# EAGLE design 3x3_Matrix (EAGLE 5.11)
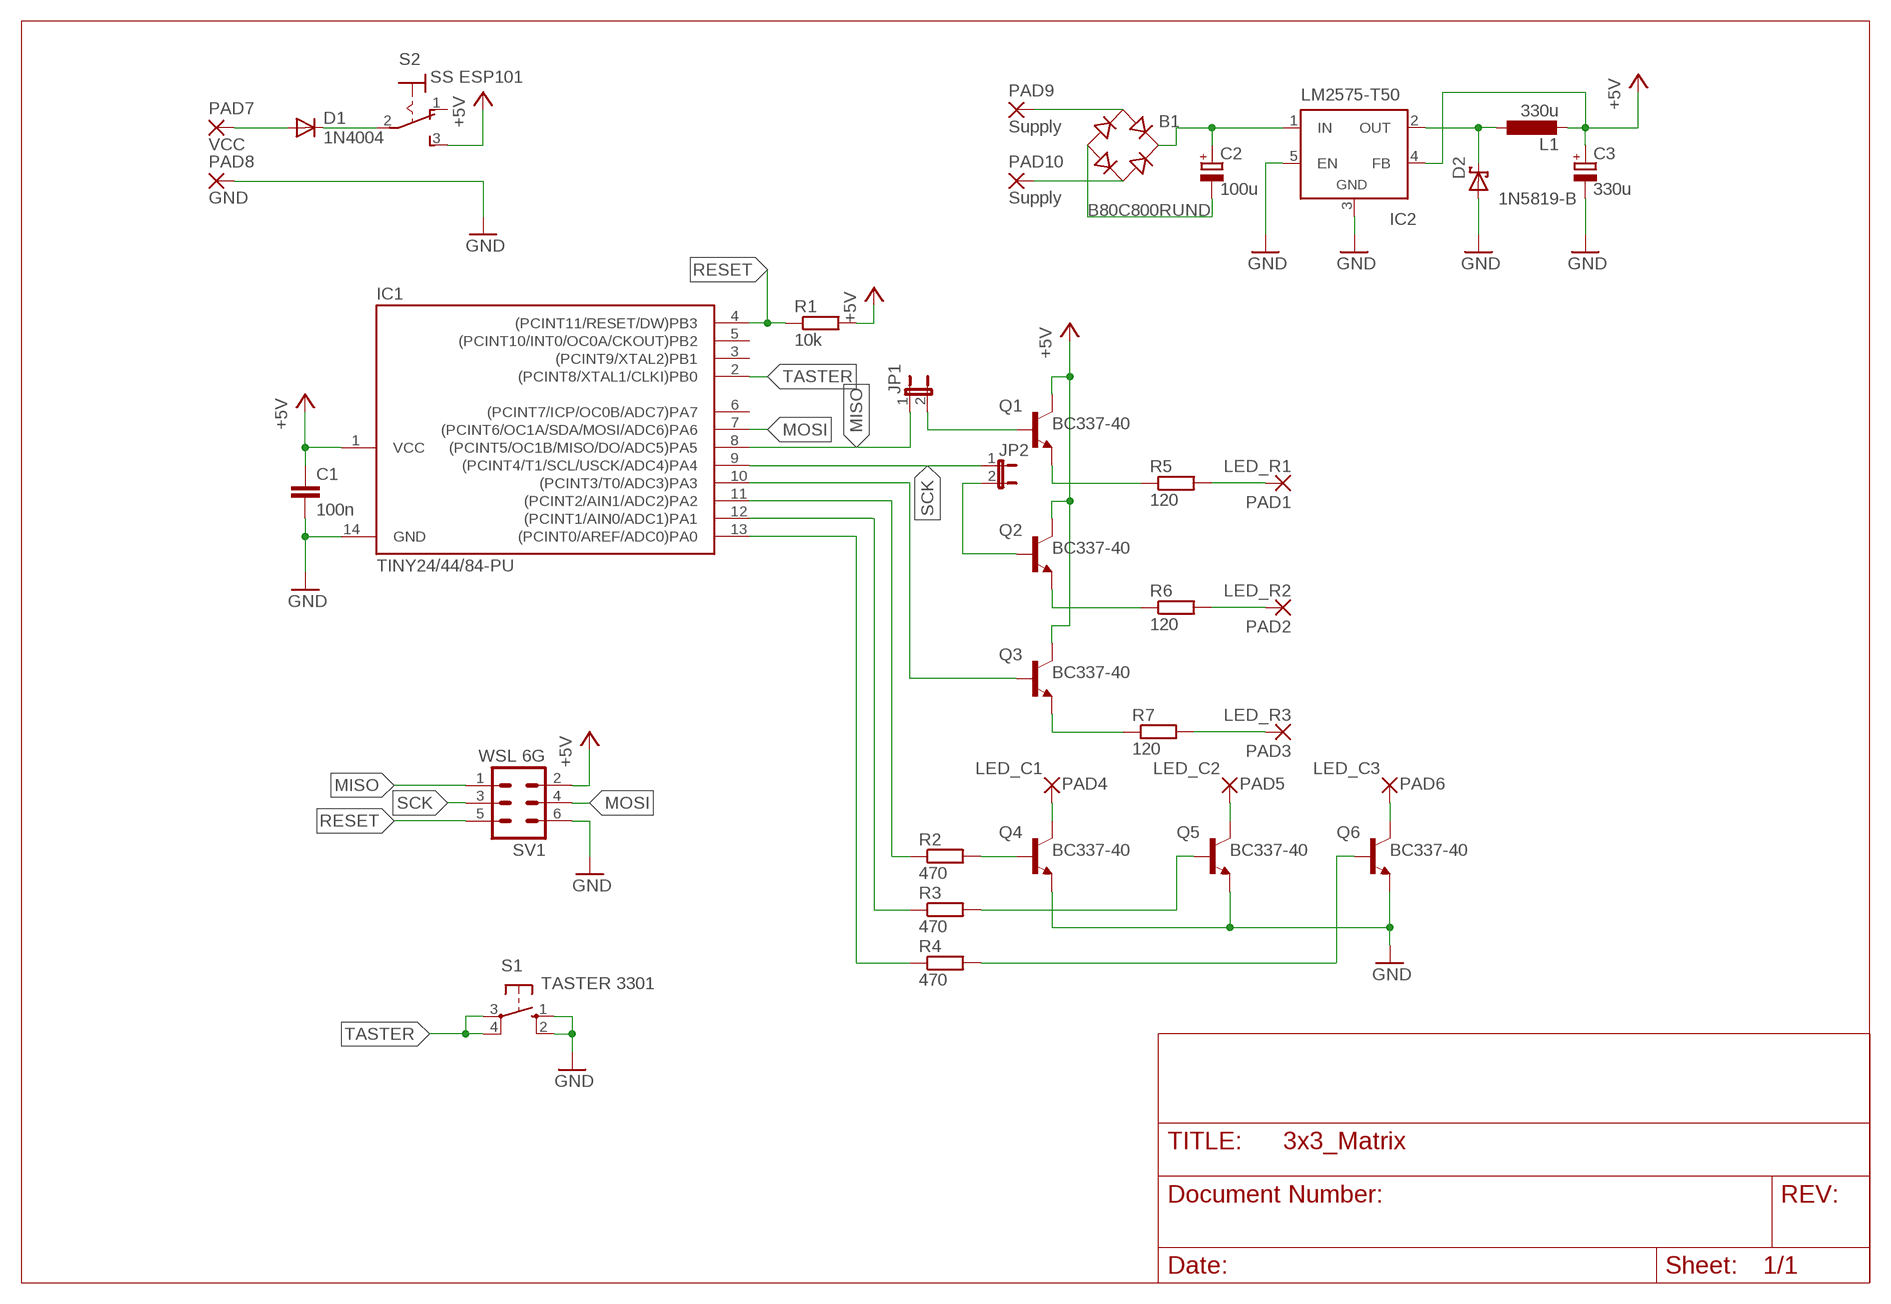
[diagram p0: schematic, sheet 1]

## Parts
B1  B80C800RUND  RB1A  [RB1A]
C1  100n  C-EU050-024X044  [C050-024X044]
C2  100u  CPOL-EUE5-6  [E5-6]
C3  330u  CPOL-EUE5-6  [E5-6]
D1  1N4004  [DO41-10]
D2  1N5819-B  [DO41-7.6]
IC1  TINY24/44/84-PU  [DIL14]
IC2  LM2575-T50  LM2596TV  [TO220-51]
JP1  JP1E  [JP1]
JP2  JP1E  [JP1]
L1  330u  L-EUIRF-1  [IRF-1]
PAD1  LED_R1  2,54/0,8  [2,54/0,8]
PAD2  LED_R2  2,54/0,8  [2,54/0,8]
PAD3  LED_R3  2,54/0,8  [2,54/0,8]
PAD4  LED_C1  2,54/0,8  [2,54/0,8]
PAD5  LED_C2  2,54/0,8  [2,54/0,8]
PAD6  LED_C3  2,54/0,8  [2,54/0,8]
PAD7  VCC  2,54/1,0  [2,54/1,0]
PAD8  GND  2,54/1,0  [2,54/1,0]
PAD9  Supply  2,54/1,0  [2,54/1,0]
PAD10  Supply  2,54/1,0  [2,54/1,0]
Q1  BC337-40  [TO92]
Q2  BC337-40  [TO92]
Q3  BC337-40  [TO92]
Q4  BC337-40  [TO92]
Q5  BC337-40  [TO92]
Q6  BC337-40  [TO92]
R1  10k  R-EU_0207/10  [0207/10]
R2  470  R-EU_0207/10  [0207/10]
R3  470  R-EU_0207/10  [0207/10]
R4  470  R-EU_0207/10  [0207/10]
R5  120  R-EU_0207/10  [0207/10]
R6  120  R-EU_0207/10  [0207/10]
R7  120  R-EU_0207/10  [0207/10]
S1  TASTER 3301  10-XX  [B3F-10XX]
S2  SS ESP101  M9040P  [M9040P]
SV1  WSL 6G  MA03-2  [MA03-2]

## Nets
+5V: C1.1 C3.+ IC1.1(VCC) IC2.4(FB) L1.2 Q1.3(C) Q2.3(C) Q3.3(C) R1.2 S2.3(S) SV1.2
GND: C1.2 C3.- D2.A IC1.14(GND) IC2.3(GND) IC2.5(EN) PAD8.1(P) Q4.1(E) Q5.1(E) Q6.1(E) S1.1(S) S1.2(S1) SV1.6
MISO: IC1.8((PCINT5/OC1B/MISO/DO/ADC5)PA5) JP1.1 SV1.1
MOSI: IC1.7((PCINT6/OC1A/SDA/MOSI/ADC6)PA6) SV1.4
N$1: IC1.10((PCINT3/T0/ADC3)PA3) Q3.2(B)
N$2: Q4.2(B) R2.2
N$3: IC1.13((PCINT0/AREF/ADC0)PA0) R4.1
N$4: IC1.12((PCINT1/AIN0/ADC1)PA1) R3.1
N$5: IC1.11((PCINT2/AIN1/ADC2)PA2) R2.1
N$6: B1.- C2.-
N$7: Q6.2(B) R4.2
N$8: B1.+ C2.+ IC2.1(IN)
N$9: JP1.2 Q1.2(B)
N$10: Q5.2(B) R3.2
N$13: D1.A PAD7.1(P)
N$14: D1.C S2.2(P)
N$15: Q1.1(E) R5.1
N$16: JP2.2 Q2.2(B)
N$17: PAD3.1(P) R7.2
N$18: PAD2.1(P) R6.2
N$19: PAD1.1(P) R5.2
N$20: PAD4.1(P) Q4.3(C)
N$21: PAD5.1(P) Q5.3(C)
N$22: PAD6.1(P) Q6.3(C)
N$23: Q2.1(E) R6.1
N$24: D2.C IC2.2(OUT) L1.1
N$25: Q3.1(E) R7.1
N$28: B1.AC1 PAD9.1(P)
N$29: B1.AC2 PAD10.1(P)
RESET: IC1.4((PCINT11/RESET/DW)PB3) R1.1 SV1.5
SCK: IC1.9((PCINT4/T1/SCL/USCK/ADC4)PA4) JP2.1 SV1.3
TASTER: IC1.2((PCINT8/XTAL1/CLKI)PB0) S1.3(P) S1.4(P1)
Unconnected: IC1.3((PCINT9/XTAL2)PB1) IC1.5((PCINT10/INT0/OC0A/CKOUT)PB2) IC1.6((PCINT7/ICP/OC0B/ADC7)PA7) S2.1(O)

## Library data of the parts
B1 = rectifier:RB1A: RECTIFIER 1 A
C1 = rcl:C-EU: CAPACITOR, European symbol
C2 C3 = rcl:CPOL-EU: POLARIZED CAPACITOR, European symbol
D1 = diode:1N4004: DIODE general purpose rectifier, 1 A
D2 = diode:1N581*: 1.0A SCHOTTKY BARRIER RECTIFIER Source: http://www.diodes.com/datasheets/ds23001.pdf
IC1 = avr-7:TINY24/44/84
IC2 = linear:LM2596T: STEP-DOWN VOLTAGE REGULATOR
JP1 JP2 = jumper:JP1E: JUMPER
L1 = rcl:L-EU: INDUCTOR, European symbol
PAD1-PAD6 = wirepad:2,54/0,8: THROUGH-HOLE PAD
PAD7-PAD10 = wirepad:2,54/1,0: THROUGH-HOLE PAD
Q1-Q6 = transistor-npn:BC337*: NPN Transistor
R1-R7 = rcl:R-EU_: RESISTOR, European symbol
S1 = switch-omron:10-XX: OMRON SWITCH; MPN: B3F-1000; OC_FARNELL: 176432; OC_NEWARK: 36M3542
S2 = switch:M9040P: TOGGLE SWITCH Marquardt
SV1 = con-lstb:MA03-2: PIN HEADER; OC_FARNELL: unknown; OC_NEWARK: unknown

## Board
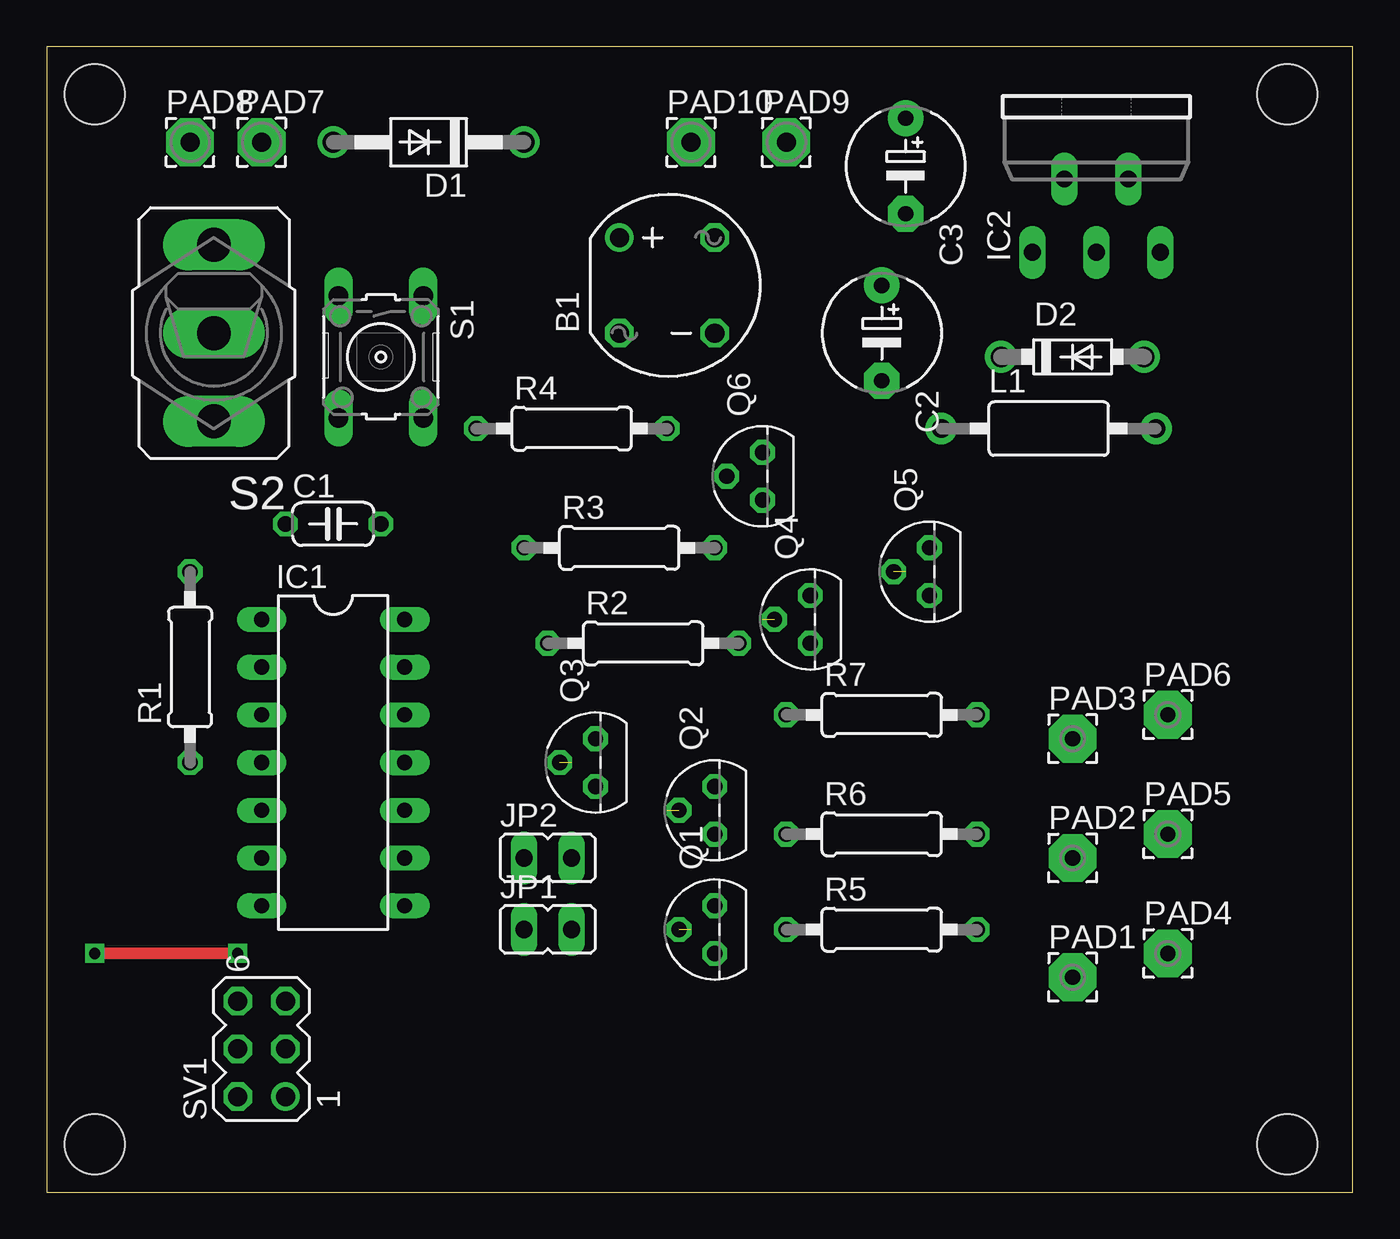
[diagram p1: board, top side]
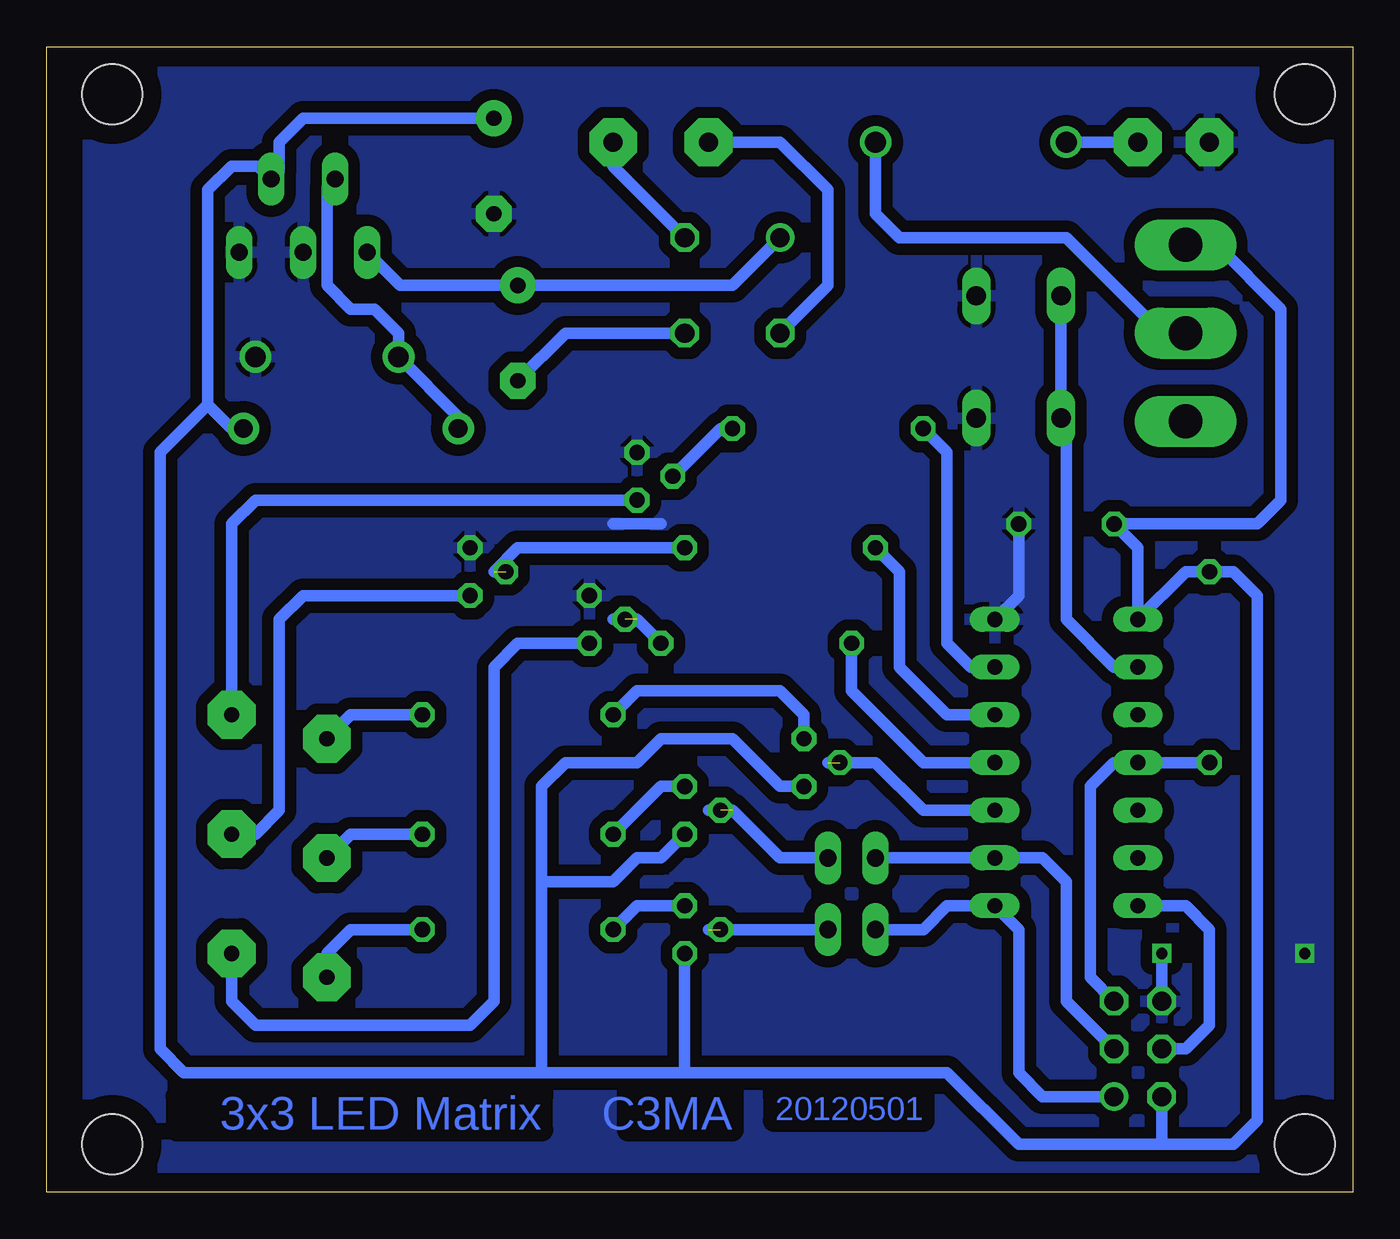
[diagram p2: board, bottom side, seen from below]

Size 69.52 x 60.95 mm. Coordinates in mm from the lower left corner, seen from the top.
Outline: 0,0 69.52,0 69.52,60.95 0,60.95 0,0
Copper layers (1*16): Top 0.035mm / dielectric 1.5mm / Bottom 0.035mm
Design rules "default": minimum track width 10mil, minimum drill 24mil, track to track 8mil, track to pad 8mil, pad to pad 8mil, via to via 8mil, smd to smd 8mil, copper to edge 40mil, drill to drill 8mil, minimum pad ring 10mil, minimum via ring 8mil, stop-mask expansion 4mil, vias tented up to drill 0mil, thermal gap 10mil
Holes 3.2 mm at 2.54,2.54 2.54,58.42 66.04,58.42 66.04,2.54

### Footprints (pad centres in the part's own frame; a part is rotated, then mirrored left to right if it is on the bottom)
RB1A = drill 1.016 round: + -2.54,2.54 | drill 1.016 octagon: - 2.54,-2.54; AC1 2.54,2.54; AC2 -2.54,-2.54
C050-024X044 = drill 0.813 octagon: 1 -2.54,0; 2 2.54,0
E5-6 = drill 0.813 pad 1.905 round: + -2.54,0 | drill 0.813 pad 1.905 octagon: - 2.54,0
DO41-10 = drill 1.118 round: A 5.08,0; C -5.08,0
DO41-7.6 = drill 1.1 pad 1.7 round: A 3.81,0; C -3.81,0
DIL14 = drill 0.813 long: 1 -7.62,-3.81; 2 -5.08,-3.81; 3 -2.54,-3.81; 4 0,-3.81; 5 2.54,-3.81; 6 5.08,-3.81; 7 7.62,-3.81; 8 7.62,3.81; 9 5.08,3.81; 10 2.54,3.81; 11 0,3.81; 12 -2.54,3.81; 13 -5.08,3.81; 14 -7.62,3.81
TO220-51 = drill 0.9 long: 1 -3.4,-8.4; 2 -1.7,-4.5; 3 0,-8.4; 4 1.7,-4.5; 5 3.4,-8.4
JP1 = drill 0.914 long: 1 0,-1.27; 2 0,1.27
IRF-1 = drill 1 pad 1.676 round: 1 -5.715,0; 2 5.715,0
2,54/0,8 = drill 0.813 pad 2.54 octagon: 1 0,0
2,54/1,0 = drill 1.016 pad 2.54 octagon: 1 0,0
TO92 = drill 0.813 octagon: 1 1.27,0; 2 0,1.905; 3 -1.27,0
0207/10 = drill 0.813 octagon: 1 -5.08,0; 2 5.08,0
B3F-10XX = drill 1.016 long: 1 -3.251,2.261; 2 3.251,2.261; 3 -3.251,-2.261; 4 3.251,-2.261
M9040P = drill 1.803 long: 1 0,4.699; 2 0,0; 3 0,-4.699
MA03-2 = drill 1.016 round: 1 -2.54,-1.27 | drill 1.016 octagon: 2 -2.54,1.27; 3 0,-1.27; 4 0,1.27; 5 2.54,-1.27; 6 2.54,1.27

### Placement (x,y rotation side)
B1  33.02,48.26 0 top
C1  15.24,35.56 0 top
C2  44.45,45.72 270 top
C3  45.72,54.61 270 top
D1  20.32,55.88 180 top
D2  54.61,44.45 0 top
IC1  15.24,22.86 270 top
IC2  55.88,58.42 0 top
JP1  26.67,13.97 270 top
JP2  26.67,17.78 270 top
L1  [IRF-1]  53.34,40.64 0 top
PAD1  54.61,11.43 0 top
PAD2  54.61,17.78 0 top
PAD3  54.61,24.13 0 top
PAD4  59.69,12.7 0 top
PAD5  59.69,19.05 0 top
PAD6  59.69,25.4 0 top
PAD7  11.43,55.88 0 top
PAD8  7.62,55.88 0 top
PAD9  39.37,55.88 0 top
PAD10  34.29,55.88 0 top
Q1  35.56,13.97 90 top
Q2  35.56,20.32 90 top
Q3  29.21,22.86 90 top
Q4  40.64,30.48 90 top
Q5  46.99,33.02 90 top
Q6  38.1,38.1 90 top
R1  7.62,27.94 90 top
R2  31.75,29.21 0 top
R3  30.48,34.29 0 top
R4  27.94,40.64 0 top
R5  44.45,13.97 0 top
R6  44.45,19.05 0 top
R7  44.45,25.4 0 top
S1  17.78,44.45 270 top
S2  8.89,45.72 180 top
SV1  11.43,7.62 90 top

### Tracks (layer width: path | path; a pad name or v marks a point on that pad's centre or on a via)
+5V
  Bottom 0.61: 35.56,6.35 43.18,6.35 | 43.18,6.35 62.23,6.35 63.5,7.62 63.5,39.37 60.96,41.91 | 35.56,6.35 Q1.3 | Q2.3 36.83,17.78 38.1,17.78 39.37,16.51 43.18,16.51 | 43.18,6.35 43.18,16.51 | 43.18,16.51 43.18,21.59 41.91,22.86 38.1,22.86 36.83,24.13 33.02,24.13 30.48,21.59 Q3.3 | 35.56,6.35 21.59,6.35 17.78,2.54 10.16,2.54 | 10.16,2.54 SV1.2 | 10.16,2.54 6.35,2.54 5.08,3.81 5.08,31.75 6.35,33.02 R1.2 8.89,33.02 IC1.1 11.43,34.29 C1.1 5.08,35.56 3.81,36.83 3.81,46.99 7.24,50.42 S2.3 | C3.+ 55.88,57.15 57.15,55.88 57.15,54.35 IC2.4 58.27,54.61 59.69,54.61 60.96,53.34 60.96,41.91 | L1.2 59.69,40.64 60.96,41.91
GND  (via drill 0.6)
  Top 0.61: v2.54,12.7 v10.16,12.7
  Bottom 0.61: IC1.14 17.78,31.75 C1.2 | 36.83,35.56 39.37,35.56 | v10.16,12.7 SV1.6
  pour Bottom (isolate 0.61): 1.27,59.69 67.31,59.69 67.31,1.27 1.27,1.27
MISO
  Bottom 0.61: JP1.1 22.86,13.97 21.59,15.24 IC1.8 17.78,13.97 17.78,6.35 16.51,5.08 SV1.1
MOSI
  Bottom 0.61: SV1.4 8.89,7.62 7.62,8.89 7.62,13.97 8.89,15.24 IC1.7
N$1  (1 unrouted)
  Bottom 0.61: IC1.10 22.86,20.32 25.4,22.86 27.94,22.86
N$2  (1 unrouted)
  Bottom 0.61: R2.2 38.1,30.48 39.37,30.48
N$3
  Bottom 0.61: IC1.13 20.32,27.94 21.59,29.21 21.59,39.37 R4.1
N$4
  Bottom 0.61: IC1.12 21.59,25.4 24.13,27.94 24.13,33.02 R3.1
N$5
  Bottom 0.61: IC1.11 22.86,22.86 26.67,26.67 R2.1
N$6
  Bottom 0.61: B1.- 41.91,45.72 C2.-
N$7
  Bottom 0.61: R4.2 33.66,40.64 Q6.2
N$8
  Bottom 0.61: B1.+ 33.02,48.26 C2.+ 50.72,48.26 IC2.1
N$9  (1 unrouted)
  Bottom 0.61: JP1.2 34.29,13.97
N$10  (1 unrouted)
  Bottom 0.61: 45.72,33.02 44.45,34.29 R3.2
N$12  (via drill 0.6)
  other vias: 10.16,12.7
N$13
  Bottom 0.61: PAD7.1 D1.A
N$14
  Bottom 0.61: 7.62,45.72 S2.2 10.16,45.72 15.24,50.8 24.13,50.8 25.4,52.07 D1.C
N$15
  Bottom 0.61: Q1.1 38.1,15.24 R5.1
N$16  (1 unrouted)
  Bottom 0.61: JP2.2 30.48,17.78 33.02,20.32 34.29,20.32
N$17
  Bottom 0.61: R7.2 53.34,25.4 PAD3.1
N$18
  Bottom 0.61: R6.2 53.34,19.05 PAD2.1
N$19
  Bottom 0.61: R5.2 53.34,13.97 54.61,12.7 PAD1.1
N$20
  Bottom 0.61: Q4.3 44.45,29.21 45.72,27.94 45.72,10.16 46.99,8.89 58.42,8.89 59.69,10.16 PAD4.1
N$21
  Bottom 0.61: Q5.3 55.88,31.75 57.15,30.48 57.15,20.32 58.42,19.05 PAD5.1
N$22
  Bottom 0.61: PAD6.1 59.69,35.56 58.42,36.83 Q6.3
N$23
  Bottom 0.61: Q2.1 36.83,21.59 R6.1
N$24
  Bottom 0.61: L1.1 47.62,41.27 D2.C 50.8,45.72 52.07,46.99 53.34,46.99 54.61,48.26 54.61,53.49 IC2.2
N$25
  Bottom 0.61: Q3.1 29.21,25.4 30.48,26.67 38.1,26.67 R7.1
N$28
  Bottom 0.61: PAD9.1 39.37,54.61 B1.AC1
N$29
  Bottom 0.61: PAD10.1 30.48,55.88 27.94,53.34 27.94,48.26 B1.AC2
RESET
  Bottom 0.61: R1.1 IC1.4 12.7,22.86 13.97,21.59 13.97,11.43 SV1.5
SCK
  Bottom 0.61: IC1.9 JP2.1 | IC1.9 17.78,17.78 | SV1.3 15.24,10.16 15.24,16.51 16.51,17.78 IC1.9
TASTER
  Bottom 0.61: IC1.2 12.7,27.94 15.24,30.48 15.24,40.21 S1.4 S1.3

### Text on the board
Bottom: 20120501 | C3MA | 3x3 LED Matrix